# EasyEDA Pro project XRAY.epro, board PCB3
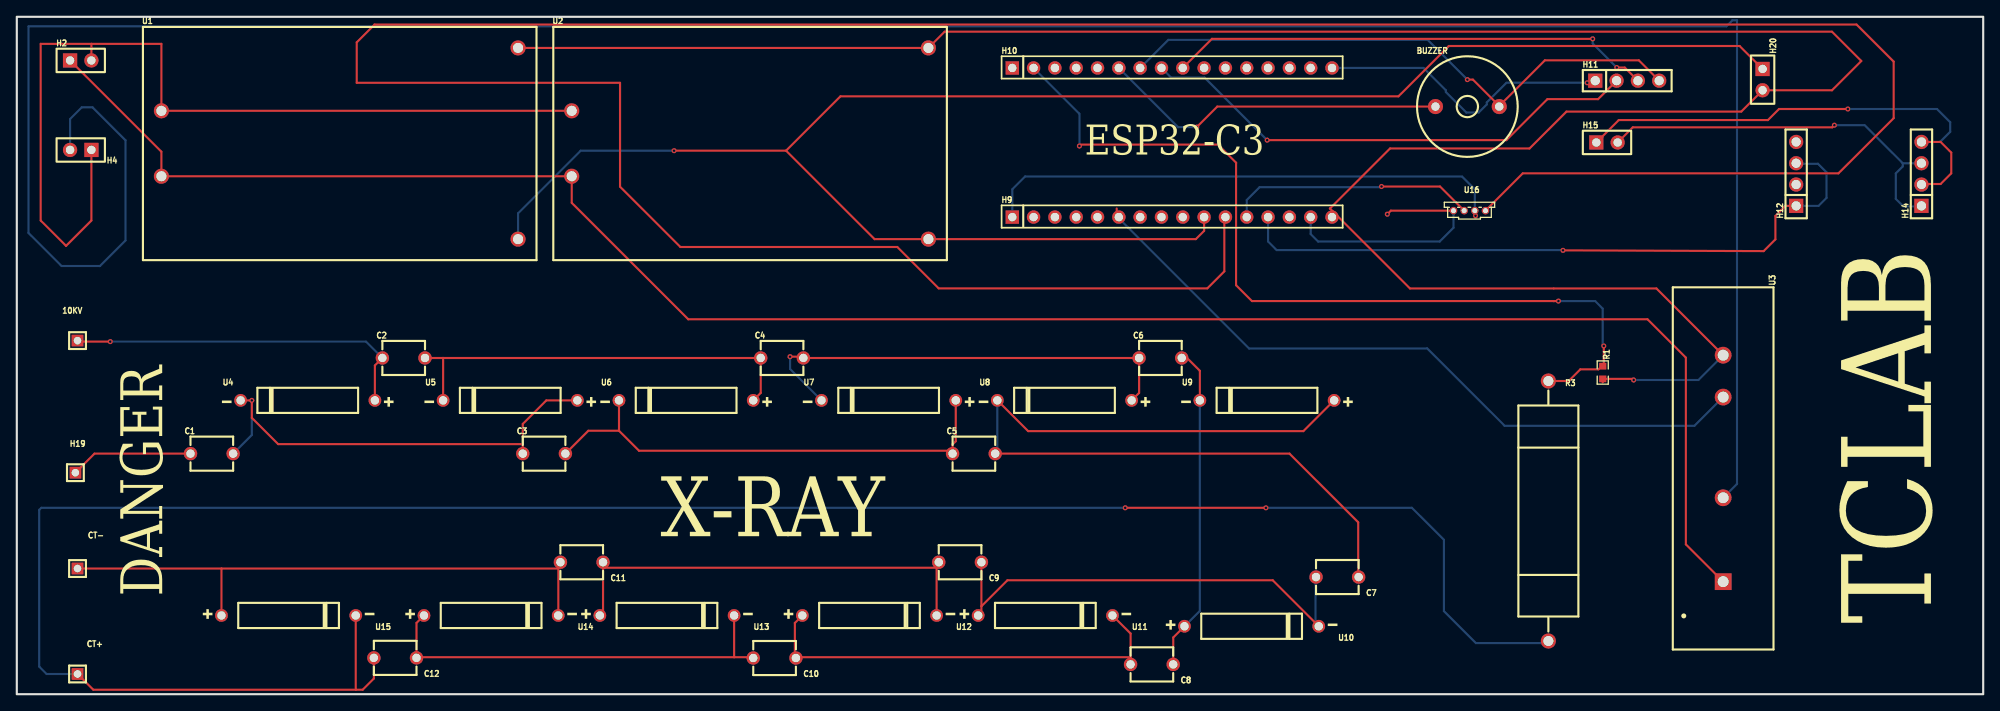
[diagram p9: board, top side]
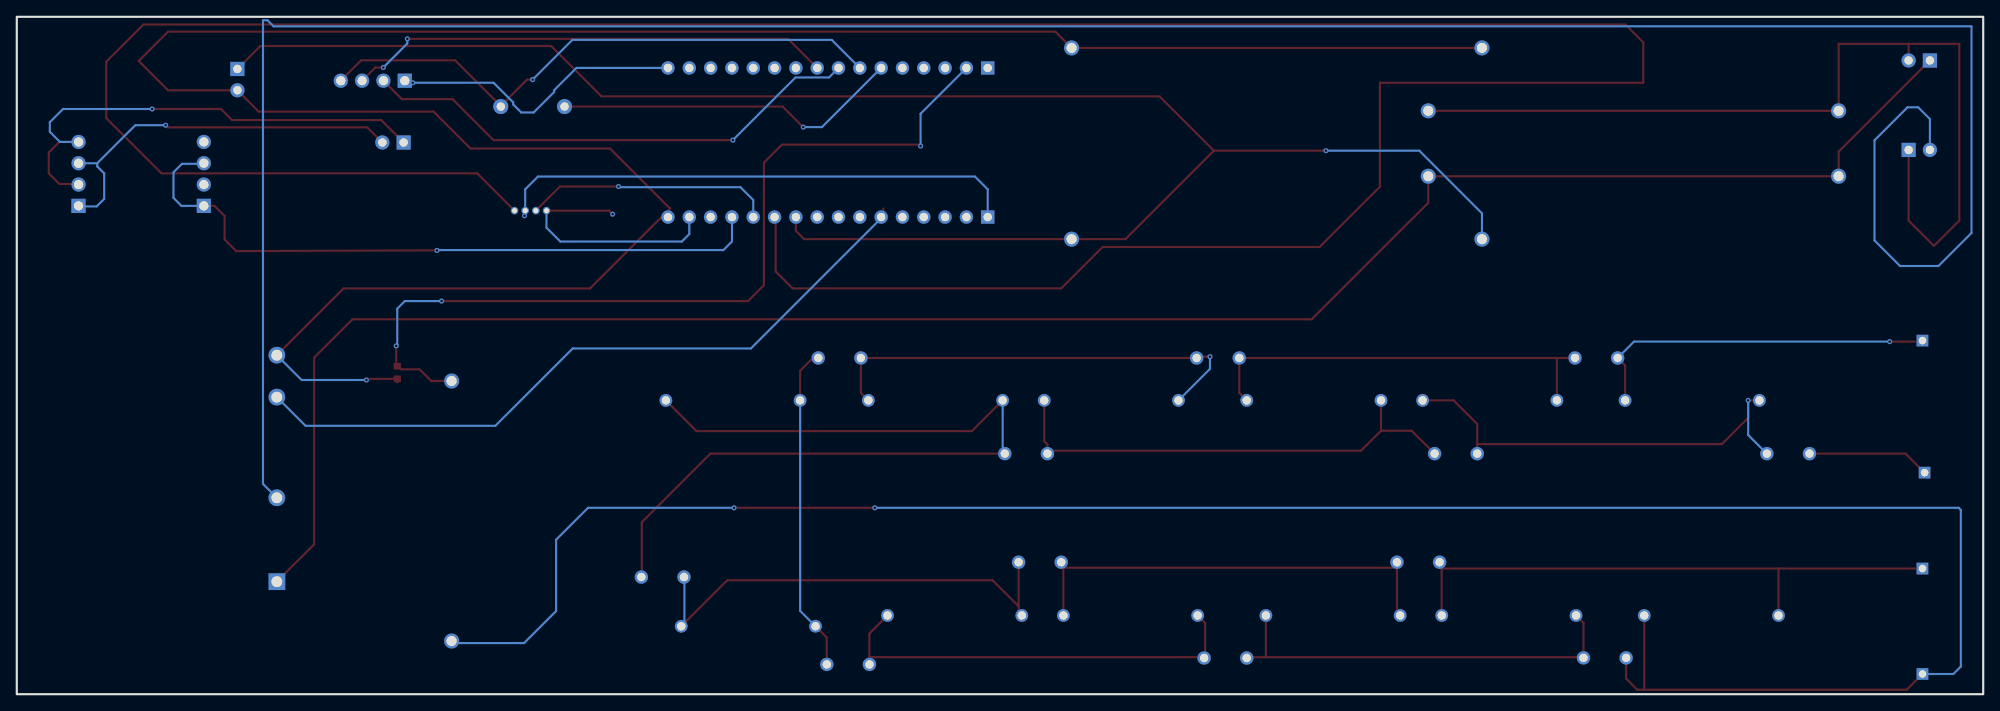
[diagram p10: board, bottom side, seen from below]

Outline 234.32 x 80.77 mm; copper layers: Top Layer, Bottom Layer. Coordinates in mm from the lower left corner of the outline.
Outline path: rectangle 0,80.77 234.32,0
Stack: Top Layer 0.035mm / Dielectric1 1.51mm FR4 er 4.5 / Bottom Layer 0.035mm

## Design rules (mm)
template: 自定义配置
spacing copperThickness1oz (default): track to track 0.102, other pairs 0.152 to 0.3
spacing copperThickness2oz: track to track 0.203, other pairs 0.152 to 0.3
track width copperThickness1oz (default): min 0.127, default 0.254, max 2.54
track width copperThickness2oz: min 0.203, default 0.254, max 2.54
differential pair differentialPair (default): width min 0.127, default 0.254, max 2.54; gap min 0.152, default 0.152
via viaSize (default): diameter min 0.5, default 0.61, max 10; hole min 0.3, default 0.305, max 6.3

## Placement (name value [footprint] x y rotation side)
10KV  -  [HDR-TH_1P-V-M_XKB_X4611WV-01I-C28D40]  7.24 42.16 0 top
BUZZER  2300Hz  [BUZ-TH_BD12.0-P7.60-D0.6-FD]  172.85 70.07 0 top
C1  30KV102K  [CAP-TH_L5.0-W4.0-P5.00-D1.0]  23.24 28.69 0 top
C2  30KV102K  [CAP-TH_L5.0-W4.0-P5.00-D1.0]  46.1 40.09 0 top
C3  30KV102K  [CAP-TH_L5.0-W4.0-P5.00-D1.0]  62.83 28.69 0 top
C4  30KV102K  [CAP-TH_L5.0-W4.0-P5.00-D1.0]  91.19 40.09 0 top
C5  30KV102K  [CAP-TH_L5.0-W4.0-P5.00-D1.0]  114.05 28.69 0 top
C6  30KV102K  [CAP-TH_L5.0-W4.0-P5.00-D1.0]  136.27 40.09 0 top
C7  30KV102K  [CAP-TH_L5.0-W4.0-P5.00-D1.0]  157.35 13.97 180 top
C8  30KV102K  [CAP-TH_L5.0-W4.0-P5.00-D1.0]  135.26 3.56 180 top
C9  30KV102K  [CAP-TH_L5.0-W4.0-P5.00-D1.0]  112.4 15.74 180 top
C10  30KV102K  [CAP-TH_L5.0-W4.0-P5.00-D1.0]  90.3 4.32 180 top
C11  30KV102K  [CAP-TH_L5.0-W4.0-P5.00-D1.0]  67.32 15.74 180 top
C12  30KV102K  [CAP-TH_L5.0-W4.0-P5.00-D1.0]  45.09 4.33 180 top
CT+  -  [HDR-TH_1P-V-M_XKB_X4611WV-01I-C28D40]  7.24 2.41 180 top
CT-  -  [HDR-TH_1P-V-M_XKB_X4611WV-01I-C28D40]  7.24 14.99 180 top
H2  -  [HDR-TH_2P-P2.54-V-F]  7.62 75.56 0 top
H4  -  [HDR-TH_2P-P2.54-V-F]  7.62 64.9 180 top
H9  ESP32C3-R  [HDR-TH_16P-P2.54-V-F]  137.67 56.89 0 top
H10  ESP2C3-L  [HDR-TH_16P-P2.54-V-F]  137.67 74.67 0 top
H11  串口  [HDR-TH_4P-P2.54-V-F]  191.9 73.15 0 top
H12  -  [HDR-TH_4P-P2.54-V-F]  212.03 62.04 90 top
H14  -  [HDR-TH_4P-P2.54-V-F]  226.96 62.04 90 top
H15  灯丝输出  [HDR-TH_2P-P2.54-V-F]  189.49 65.79 0 top
H19  10KV  [HDR-TH_1P-V-M_XKB_X4611WV-01I-C28D40]  6.98 26.42 0 top
H20  灯丝驱动电源  [HDR-TH_2P-P2.54-V-F]  208.03 73.28 270 top
R1  120K  [R0603]  188.98 38.35 270 top
R3  20G  [RES-TH_BD7.0-L25.0-P31.00-D1.0]  182.5 21.84 270 top
U1  HLK-10M03  [PWRM-TH_HLK-10M05]  38.48 65.66 0 top
U2  HLK-10M03  [PWRM-TH_HLK-10M05]  87.38 65.66 0 top
U3  PMN5D6132  [DIP-4_L43.2-W12.0-PMN5A2032]  203.33 26.92 270 top
U4  2CL77  [DIO-TH_BD3.0-L12.0-P16.00-D0.6]  34.67 35.04 0 top
U5  2CL77  [DIO-TH_BD3.0-L12.0-P16.00-D0.6]  58.8 35.04 0 top
U6  2CL77  [DIO-TH_BD3.0-L12.0-P16.00-D0.6]  79.76 35.04 0 top
U7  2CL77  [DIO-TH_BD3.0-L12.0-P16.00-D0.6]  103.89 35.04 0 top
U8  2CL77  [DIO-TH_BD3.0-L12.0-P16.00-D0.6]  124.84 35.04 0 top
U9  2CL77  [DIO-TH_BD3.0-L12.0-P16.00-D0.6]  148.97 35.04 0 top
U10  2CL77  [DIO-TH_BD3.0-L12.0-P16.00-D0.6]  147.14 8.1 180 top
U11  2CL77  [DIO-TH_BD3.0-L12.0-P16.00-D0.6]  122.56 9.39 180 top
U12  2CL77  [DIO-TH_BD3.0-L12.0-P16.00-D0.6]  101.61 9.39 180 top
U13  2CL77  [DIO-TH_BD3.0-L12.0-P16.00-D0.6]  77.48 9.39 180 top
U14  2CL77  [DIO-TH_BD3.0-L12.0-P16.00-D0.6]  56.52 9.39 180 top
U15  2CL77  [DIO-TH_BD3.0-L12.0-P16.00-D0.6]  32.39 9.39 180 top
U16  AHT25  [SENSOR-TH_AHT25]  173.1 57.66 0 top

## Footprints (pads in the part's own frame, mm; a bottom-side part is the same pattern mirrored in y, then rotated)
BUZ-TH_BD12.0-P7.60-D0.6-FD
  round 1.8 hole 1: 1(-3.8,0) 2(3.8,0)
CAP-TH_L5.0-W4.0-P5.00-D1.0
  round 1.6 hole 1: 1(-2.54,0) 2(2.54,0)
DIO-TH_BD3.0-L12.0-P16.00-D0.6
  round 1.524 hole 1: 1(-8,0) 2(8,0)
DIP-4_L43.2-W12.0-PMN5A2032
  rect 2x2 hole 1.3: 1(13.5,0)
  round 2 hole 1.3: 2(3.5,0) 3(-8.5,0) 4(-13.5,0)
HDR-TH_1P-V-M_XKB_X4611WV-01I-C28D40
  rect 1.4x1.4 hole 0.9: 1(0,0)
HDR-TH_2P-P2.54-V-F
  rect 1.7x1.7 hole 1: 1(-1.27,0)
  round 1.7 hole 1: 2(1.27,0)
HDR-TH_4P-P2.54-V-F
  rect 1.7x1.7 hole 1.1: 1(-3.81,0)
  round 1.7 hole 1.1: 2(-1.27,0) 3(1.27,0) 4(3.81,0)
HDR-TH_16P-P2.54-V-F
  rect 1.6x1.6 hole 1: 1(-19.05,0)
  round 1.6 hole 1: 2(-16.51,0) 3(-13.97,0) 4(-11.43,0) 5(-8.89,0) 6(-6.35,0) 7(-3.81,0) 8(-1.27,0) 9(1.27,0) 10(3.81,0) 11(6.35,0) 12(8.89,0) 13(11.43,0) 14(13.97,0) 15(16.51,0) 16(19.05,0)
PWRM-TH_HLK-10M05
  round 1.8 hole 1.2: 1(-21.25,3.9) 2(-21.25,-3.9) 3(21.25,11.4) 4(21.25,-11.4)
R0603
  rect 0.806x0.864 smd: 1(-0.753,0) 2(0.753,0)
RES-TH_BD7.0-L25.0-P31.00-D1.0
  round 1.8 hole 1.2: 1(-15.5,0) 2(15.5,0)
SENSOR-TH_AHT25
  round 0.9 hole 0.6: 1(-1.905,0) 2(-0.635,0) 3(0.635,0) 4(1.905,0)

## Nets
As in the schematic.

Pads without a net: H9 2 3 4 5 7 8 9 14; H10 1 3 4 5 10 11 12 13 14 15; H12 2 4

## Via types
v1: diameter 0.61, hole 0.305, Top Layer to Bottom Layer, 23 vias

## Routing (per net, layer and track width the routed paths; a pad name or vN(x,y) marks a point on that pad's centre or on a via; arc(x,y) is an arc through that point)
3.3V: length 217
  Top Layer w0.254: H20.1 205.29,77.28 170.64,77.28 164.63,71.28 98.14,71.28 91.66,64.81 ; H9.10 141.48,55.25 140.49,54.26 U2.4 102.21,54.26 91.66,64.81 ; 91.66,64.81 v1(78.32,64.81)
  Bottom Layer w0.254: v1(78.32,64.81) 67.19,64.81 59.73,57.35 U1.4
3.3V-SW: length 81.3
  Top Layer w0.254: v1(184.24,52.92) 208.15,52.83 209.55,54.23 209.55,57.02 210.76,58.23 H12.1
  Bottom Layer w0.254: H12.3 212.09,63.25 214.63,63.25 215.65,62.23 215.65,59.18 214.69,58.23 H12.1 ; H9.13 149.1,53.97 150.11,52.96 184.2,52.96 v1(184.24,52.92)
220V-SW: length 84.9
  Top Layer w0.254: v1(131.08,56.99) 131.06,57 131.06,57.91
  Bottom Layer w0.254: U3.3 199.91,32 177.29,32 168.07,41.22 146.84,41.22 v1(131.08,56.99)
GND: length 303
  Top Layer w0.254: v1(192.66,37.46) 192.52,37.6 R1.2 188.98,37.21 188.98,37.21 ; 156.48,57.91 166.01,48.38 195.37,48.38 U3.4 ; 156.48,57.91 156.46,57.91 ; 156.48,57.91 163.64,65.07 180.26,65.07 184.66,69.47 205.49,69.47 H20.2 216.29,72.01 219.79,75.5 216.29,78.99 110.56,78.99 U2.3 U1.3
  Bottom Layer w0.254: U3.4 200.37,37.46 v1(192.66,37.46)
120KV+: length 263.3
  Top Layer w0.254: C12.2 42.55,1.87 41.22,0.54 40.39,0.54 ; v1(132.08,22.22) v1(148.84,22.22) ; 40.39,0.54 U15.1 ; 40.39,0.54 9.11,0.54 CT+.1
  Bottom Layer w0.254: v1(132.08,22.22) 2.92,22.22 2.67,21.97 2.67,3.3 3.56,2.41 CT+.1 ; R3.2 182.25,6.1 173.86,6.1 170.05,9.91 170.05,18.41 166.24,22.22 v1(148.84,22.22)
120KV-DET: length 104.6
  Top Layer w0.254: 183.13,46.87 183.14,46.88 ; 183.14,46.88 v1(183.7,46.88) ; 183.14,46.88 147.18,46.88 145.29,48.77 145.29,63.37 143.13,65.53 126.62,65.53 ; R3.1 184.92,37.34 186.31,38.73 188.47,38.73 188.85,39.12 ; v1(189.1,41.53) 189.1,39.23 R1.1
  Bottom Layer w0.254: v1(126.62,65.36) 126.62,69.21 H10.2 ; v1(183.7,46.88) 188.07,46.88 188.98,45.97 188.98,41.66 v1(189.1,41.53)
$1N1416: length 325
  Bottom Layer w0.254: U3.2 204.98,25.07 204.98,80.34 204.42,80.34 203.71,79.63 1.4,79.63 1.4,54.99 5.33,51.05 9.91,51.05 12.95,54.1 12.95,66.04 9.02,69.98 7.75,69.98 6.35,68.58 H4.2
$1N2335: length 50.5
  Top Layer w0.254: C2.2 50.8,40.09 ; 50.8,40.09 U5.1 ; 50.8,40.09 C4.1 88.65,35.93 U6.2
$1N2339: length 55.5
  Top Layer w0.254: U4.1 v1(28.01,35.04) 28.01,32.95 31.14,29.82 60.29,29.82 ; 60.29,29.82 60.29,32.22 63.1,35.04 U5.2 ; 60.29,29.82 C3.1
  Bottom Layer w0.254: v1(28.01,35.04) 28.01,30.91 C1.2
$1N2611: length 53.8
  Top Layer w0.254: v1(92.14,40.25) 93.57,40.25 C4.2 C6.1 133.73,35.93 U8.2
  Bottom Layer w0.254: v1(92.14,40.25) 92.14,38.78 U7.1
$1N2615: length 58.4
  Top Layer w0.254: 111.51,29.03 74.14,29.03 71.76,31.41 ; 111.51,29.03 C5.1 ; 111.51,29.03 111.51,29.78 111.89,30.16 U7.2 ; C3.2 68.1,31.41 71.76,31.41 ; 71.76,31.41 U6.1
$1N2617: length 38.3
  Top Layer w0.254: 137.8,4.33 137.8,6.77 U10.2 ; U9.1 140.97,38.56 139.44,40.09 C6.2
  Bottom Layer w0.254: U10.2 140.97,9.94 U9.1
$1N2623: length 102.8
  Top Layer w0.254: U8.1 120.51,31.37 153.31,31.37 U9.2 ; C5.2 151.65,28.69 159.84,20.5 159.84,14.02 C7.1
  Bottom Layer w0.254: U8.1 116.84,28.94 C5.2
$1N2899: length 51.4
  Top Layer w0.254: 92.72,4.42 92.72,8.5 U12.2 ; 92.72,4.42 132.72,4.42 ; 92.72,4.42 92.72,4.33 ; 132.72,4.33 132.72,4.42 ; 132.72,4.42 132.72,7.23 U11.1
$1N2903: length 56.3
  Top Layer w0.254: 114.94,10.49 118.04,13.59 149.65,13.59 U10.1 ; 114.94,10.49 C9.1 ; 114.94,10.49 114.94,9.77 U11.2
  Bottom Layer w0.254: U10.1 154.76,8.48 154.76,13.92 C7.2
$1N2905: length 50.4
  Top Layer w0.254: 85.48,4.42 87.55,4.42 87.64,4.33 ; 85.48,4.42 U13.1 ; 85.48,4.42 47.63,4.42 ; 47.63,4.42 47.63,8.5 U14.2 ; 47.63,4.42 C12.1
$1N2911: length 52.7
  Top Layer w0.254: 69.86,15.08 C11.1 ; 69.86,15.08 109.61,15.08 ; 69.86,15.08 69.86,9.77 U13.2 ; U12.1 109.61,15.08 ; 109.61,15.08 109.86,15.34 C9.2
$1N2933: length 42.6
  Top Layer w0.254: v1(11.14,42.04) 7.36,42.04 10KV.1 ; U4.2 42.67,39.2 C2.1
  Bottom Layer w0.254: C2.1 41.61,42.04 v1(11.14,42.04)
$1N2946: length 14.7
  Top Layer w0.254: C1.1 9.25,28.69 H19.1
$1N3033: length 69.3
  Top Layer w0.254: U15.2 24.39,14.99 ; 24.39,14.99 CT-.1 ; 24.39,14.99 64.53,14.99 ; 64.53,14.99 64.53,9.4 U14.1 ; 64.53,14.99 64.53,15.5 C11.2
$1N4648: length 35.4
  Top Layer w0.254: H11.1 187.84,72.9 v1(187.13,72.9)
  Bottom Layer w0.254: H10.16 167.63,74.67 170.29,72.01 170.29,71.8 172.72,69.36 174.2,69.36 175.16,70.32 175.16,70.56 177.5,72.9 v1(187.13,72.9)
$1N4656: length 60.7
  Top Layer w0.254: H11.2 188.43,70.95 182.38,70.95 177.49,66.06 v1(148.99,66.06)
  Bottom Layer w0.254: H10.8 137.53,73.53 141.52,73.53 v1(148.99,66.06)
$1N4664: length 58.1
  Top Layer w0.254: v1(190.65,74.72) 191.6,74.72 H11.3 ; H10.9 142.41,78.14 v1(187.78,78.14)
  Bottom Layer w0.254: v1(190.65,74.72) 187.78,77.59 v1(187.78,78.14)
$1N4672: length 69.8
  Top Layer w0.254: v1(172.85,73.28) 173.51,73.28 176.65,70.14 ; 176.65,70.14 182.08,75.58 193.28,75.58 H11.4 ; 176.65,70.14 BUZZER.2
  Bottom Layer w0.254: H10.7 137.21,78.02 168.11,78.02 v1(172.85,73.28)
$1N5062: length 60.2
  Top Layer w0.254: v1(218.18,69.78) 209.98,69.78 208.66,68.45 190.88,68.45 H15.1 ; H14.4 229.23,65.85 230.51,64.58 230.51,62.1 229.23,60.83 227.02,60.83 H14.2
  Bottom Layer w0.254: H14.4 229.17,65.85 230.38,67.06 230.38,68.2 228.8,69.78 v1(218.18,69.78)
$1N5074: length 47
  Top Layer w0.254: v1(216.58,67.85) 216.32,67.59 192.56,67.59 190.76,65.79
  Bottom Layer w0.254: H14.3 224.73,63.31 ; 224.73,63.31 220.19,67.85 v1(216.58,67.85) ; 224.73,63.31 224.73,62.93 223.9,62.1 223.9,59.05 224.79,58.17 226.89,58.17 H14.1
$1N11280: length 239.3
  Top Layer w0.254: U3.1 198.88,17.87 198.88,40.13 194.31,44.7 80.01,44.7 66.13,58.59 U2.2 U1.2 17.23,64.68 H2.1
$1N11281: length 111.3
  Top Layer w0.254: 8.89,77.54 2.85,77.54 2.85,56.48 5.87,53.46 8.89,56.48 H4.1 ; 8.89,77.54 17.23,77.54 U1.1 U2.1 ; 8.89,77.54 H2.2
$1N12469: length 30.2
  Top Layer w0.254: v1(163.31,57.24) 163.73,57.66 U16.1
  Bottom Layer w0.254: U16.1 171.2,55.63 169.55,53.97 155.07,53.97 154.18,54.86 H9.15
$1N12482: length 29.8
  Top Layer w0.254: U16.2 169.59,60.54 v1(162.62,60.54)
  Bottom Layer w0.254: H9.12 146.56,58.93 148.08,60.45 162.54,60.45 v1(162.62,60.54)
$1N12487: length 378.8
  Top Layer w0.254: U16.4 179.45,62.1 217.06,62.1 223.65,68.69 223.65,75.42 219.22,79.85 42.63,79.85 40.51,77.72 40.51,72.9 71.88,72.9 71.88,60.51 79.07,53.32 104.92,53.32 109.85,48.39 141.86,48.39 143.89,50.42 143.89,56.76 H9.11
$1N12492: length 62.9
  Top Layer w0.254: U16.3 173.74,57.13 v1(173.82,57.04)
  Bottom Layer w0.254: U16.3 173.74,60.2 172.21,61.72 120.14,61.72 118.62,60.2 H9.1
$1N12533: length 41.7
  Top Layer w0.254: BUZZER.1 143.05,70.07 v1(140.6,67.61)
  Bottom Layer w0.254: v1(140.6,67.61) 138.37,67.61 H10.6

## Text on the board
Top Silkscreen Layer: ESP32-C3 | DANGER | X-RAY | TCLAB
